# Altium schematic sheet Spindle.SchDoc: Spindle
size A4; CompanyName: James Cook University; DrawnBy: CC2511 AS2 Group 1; Organization: James Cook University; Revision: 1.0; SheetNumber: 4; SheetTotal: 4; ProjectName: *ProjectName
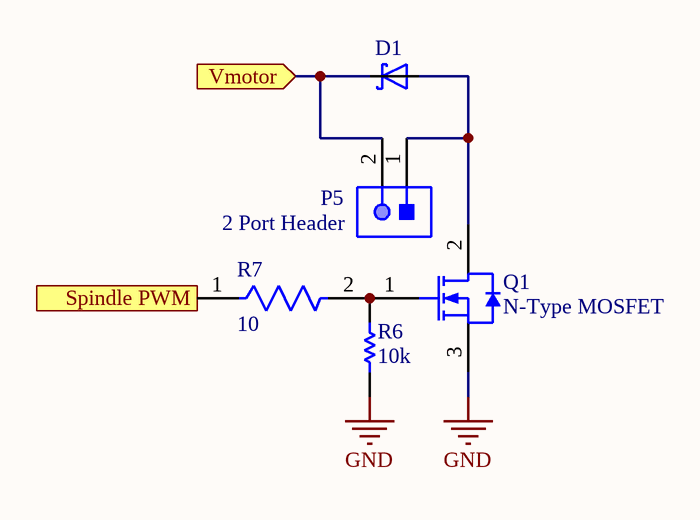
[diagram p0: Spindle.SchDoc]

## Parts
D1  (no value)  [SS34-1]
P5  2 Port Header  [JST-B2P-VH(LF)(SN)_V]
Q1  Manufacturer Part Number: N-Type MOSFET  [NXP-SOT404_L]  (hidden comment: BUK9635-55A,118)
R6  10k  [RESC2013X60X35ML10T20]
R7  10  [FP-CRCW0805-e3-IPC_B]

## Ports
Spindle PWM (in), Vmotor (in)

## Nets
GND: Q1.3(S) R6.1
Spindle PWM: R7.1 ; port Spindle PWM
Vmotor: D1.C P5.2 ; port Vmotor
NetD1_A: D1.A P5.1 Q1.2(D)
NetQ1_1: Q1.1(G) R6.2 R7.2

## Notes on the sheet
- Date:
- Sheet
- of
- Time:
- Revision:
- Drawn by:
- File:

## Library data of the parts
D1 = SS34-A: 34 Position Cable Assembly Rectangular Socket to Cable 3.00' (914.40mm); MP: SS34A; MF: TE Connectivity; Availability: Unavailable; SnapEDA_Link: https://www.snapeda.com/parts/SS34A/TE%20Connectivity%20AMP%20Connectors/view-part/585916/?ref=snap; Check_prices: https://www.snapeda.com/parts/SS34A/TE%20Connectivity%20AMP%20Connectors/view-part/585916/?ref=eda; Package: DO-214 Multicomp; Price: None; Value: *
P5 = JST_B2P-VH(LF)(SN): Male Header, Pitch 3.96 mm, 1 x 2 Position, Height 10.9 mm, Tail Length 3.7 mm, -25 to 85 degC, RoHS, Bulk; Capacitance: 27 pF; Type (Capacitors): C0G; Voltage Rating (DC): 50 V; Resistance: 100000000000 Ohm; Tolerance: 5%; ComponentLink2Description: Datasheet; Height: 0.8 mm; Radiation Hardening: No; Pins: 2; Package Quantity: 4000; Max Operating Temperature: 125degC; Width: 0.8 mm; PackageDescription: Male Header, Pitch 3.96 mm, 1 x 2 Position, Height 10.9 mm, Tail Length 3.7 mm; Case/Package: 0603; PackageReference: B2P-VH(LF)(SN); Voltage Rating: 50 V; REACH SVHC: No SVHC; Mount: Surface Mount; Min Operating Temperature: -55degC; Case Code (Metric): 1608; ComponentLink2URL: http://www.jst-mfg.com/product/pdf/eng/eVH.pdf; DatasheetVersion: May-16; RoHSCompliant: True; ComponentLink1Description: Manufacturer URL; Case Code (Imperial): 0603; Length: 1.6 mm; Packaging: Tape and Reel; ComponentLink1URL: http://www.jst.com/home2.html
Q1 = BUK9635-55A,118: 3G PENTABAND 824-2170MHZ STRAIGH; Manufacturer: Nexperia; Supplier 1: Digi-Key; RoHS: Yes; Category: MOSFETs; Stock 1: 28; Pricing 1: 1=1.16000, 10=1.03500, 100=0.80710 (USD); RoHS Compliant: Yes; Supplier Part Number 1: 1727-7196-1-ND
R6 = CMP-2000-05025-1: Chip Resistor, 10 KOhm, +/- 5%, 0.125 W, -55 to 155 degC, 0805 (2012 Metric), RoHS, Tape and Reel; Manufacturer: Yageo; Resistor Element Type: ThickFilm; Voltage Rating: 150V; Product Range: RCSeries; SVHC: ToBeAdvised; Resistor Case Style: 0805[2012Metric]; Temperature Coefficient: ±100ppm/degC; Power Rating: 250mW; Resistance: 10kohm; Automotive Qualification Standard: -; Datasheet Version: REV. 2, 09/2004; Packaging: CutTape; Resistance Tolerance: ±5%; MSL: MSL1-Unlimited; Manufacturer URL: http://www.yageo.com/; Datasheet URL: http://www.yageo.ru/pdf/RC0805.pdf; Package Description: 2-Pin Surface Mounted Device, Body 2 x 1.25 mm; Package Reference: 805
R7 = CMP-2001-04190-2: RES Thick Film, 10Ω, 1%, 0.125W, 100ppm/°C, 0805; Voltage Rating (DC): 150V; Max Power Dissipation: 125mW; Resistance: 10R; Radiation Hardening: No; Length: 0.079inch; Weight: 0.000194oz; Temperature Coefficient: 100ppm/°C; Packaging: Tape and Reel; Width: 0.049inch; Min Operating Temperature: -55°C; Power Rating: 125mW; Number of Pins: 2; RoHS Compliant: Yes; Lead Free: Lead Free; Number of Terminations: 2; Height: 0.02inch; Size Code: 0805; Series: CRCW; Package Quantity: 10000; Tolerance: 1%; Case Code (Metric): 2012; Resistor Type: Thick Film; Case Code (Imperial): 0805; Termination: SMD/SMT; Case/Package: 0805; Resistance Tolerance: 1%; Features: Automotive AEC-Q200; Max Operating Temperature: 155°C; Contact Plating: Tin; Voltage Rating: 150V